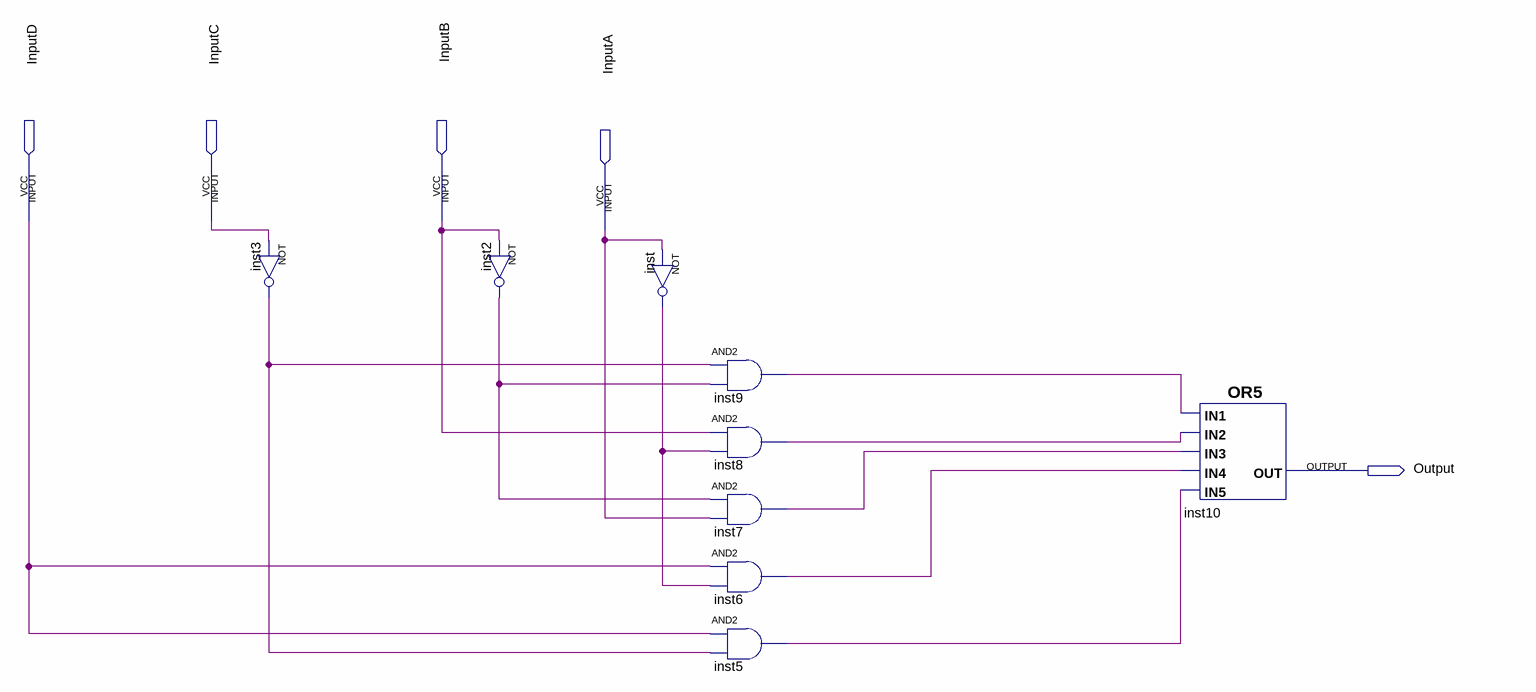
[diagram p0: schematic sheet]
// Quartus schematic SegC.bdf as structural Verilog: 9 symbols, 5 pins
module SegC (
  input  InputD,
  input  InputC,
  input  InputB,
  input  InputA,
  output Output
);

  wire inst2_out, inst3_out, inst5_out, inst6_out, inst7_out, inst8_out, inst9_out, inst_out;

  not inst3 (inst3_out, InputC);
  not inst2 (inst2_out, InputB);
  not inst (inst_out, InputA);
  and inst9 (inst9_out, inst3_out, inst2_out);
  and inst8 (inst8_out, InputB, inst_out);
  and inst7 (inst7_out, inst2_out, InputA);
  and inst6 (inst6_out, InputD, inst_out);
  and inst5 (inst5_out, InputD, inst3_out);
  or inst10 (Output, inst9_out, inst8_out, inst7_out, inst6_out, inst5_out);
endmodule
